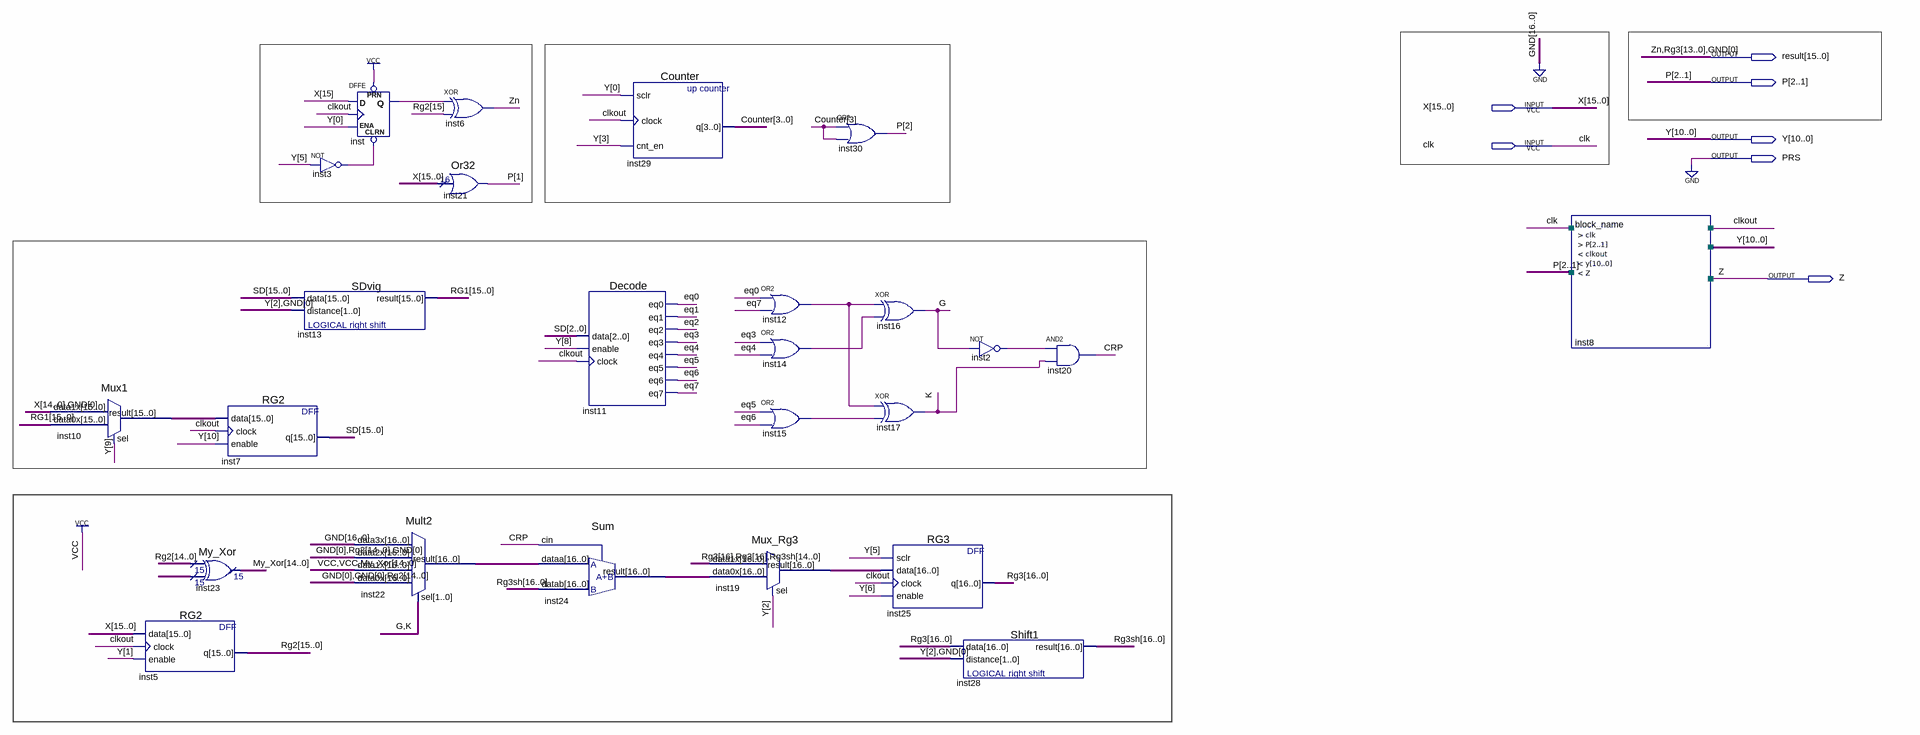
[diagram p0: schematic sheet]
// Quartus schematic OA.bdf as structural Verilog: 25 symbols, 7 pins
module OA (
  input  [15:0] X,
  input  clk,
  output [15:0] result,
  output [2:1] P,
  output [10:0] Y,
  output PRS,
  output Z
);

  wire clkout, CRP, eq0, eq1, eq2, eq3, eq4, eq5, eq6, eq7, G, inst2_out, inst3_out, inst12_out, inst14_out,
       inst15_out, inst_q, K;
  wire [3:0] Counter;
  wire [14:0] My_Xor;
  wire [15:0] inst10_result, RG1, Rg2, SD;
  wire [16:0] inst19_result, inst22_result, inst24_result, Rg3sh;
  wire [16:14] Rg3;

  Mux1 inst10 (.data1x({X[14:0], 1'b0}), .data0x(RG1), .sel(Y[9]), .result(inst10_result));
  RG2 inst5 (.data(X), .clock(clkout), .enable(Y[1]), .q(Rg2));
  RG2 inst7 (.data(inst10_result), .clock(clkout), .enable(Y[10]), .q(SD));
  My_Xor inst23 (.data0x(Rg2[14:0]), .data1x({15{1'b1}}), .result(My_Xor));
  not inst3 (inst3_out, Y[5]);
  SDvig inst13 (.data(SD), .distance({Y[2], 1'b0}), .result(RG1));
  DFFE inst (.PRN(1'b1), .CLRN(inst3_out), .D(X[15]), .CLK(clkout), .ENA(Y[0]), .Q(inst_q));
  Mult2 inst22 (
    .data3x({17{1'b0}}), .data2x({1'b0, Rg2[14:0], 1'b0}), .data1x({2'b11, My_Xor}),
    .data0x({2'b00, Rg2[14:0]}), .sel({G, K}), .result(inst22_result));
  Or32 inst21 (.data(X), .result(P[1]));
  xor inst6 (result[15], inst_q, Rg2[15]);
  Sum inst24 (.dataa(inst22_result), .datab(Rg3sh), .cin(CRP), .result(inst24_result));
  Decode inst11 (
    .data(SD[2:0]), .enable(Y[8]), .clock(clkout), .eq0(eq0), .eq1(eq1), .eq2(eq2), .eq3(eq3), .eq4(eq4),
    .eq5(eq5), .eq6(eq6), .eq7(eq7));
  Counter inst29 (.sclr(Y[0]), .clock(clkout), .cnt_en(Y[3]), .q(Counter));
  Mux_Rg3 inst19 (.data1x({{2{Rg3[16]}}, Rg3sh[14:0]}), .data0x(inst24_result), .sel(Y[2]), .result(inst19_result));
  or inst12 (inst12_out, eq0, eq7);
  or inst14 (inst14_out, eq3, eq4);
  or inst15 (inst15_out, eq5, eq6);
  or inst30 (P[2], Counter[3], Counter[3]);
  xor inst16 (G, inst12_out, inst14_out);
  xor inst17 (K, inst12_out, inst15_out);
  RG3 inst25 (.sclr(Y[5]), .data(inst19_result), .clock(clkout), .enable(Y[6]), .q({Rg3, result[14:1]}));
  not inst2 (inst2_out, G);
  Shift1 inst28 (.data({Rg3, result[14:1]}), .distance({Y[2], 1'b0}), .result(Rg3sh));
  and inst20 (CRP, inst2_out, K);
  block_name inst8 (.clk(clk), .P(P), .clkout(clkout), .y(Y), .Z(Z));

  assign PRS = 1'b0;
  assign result[0] = 1'b0;

  // Other names for the same wires on the sheet: Rg3[13:0] = result[14:1]; Zn = result[15]
endmodule
